# Altium project MungBeanSprout.PrjPCB
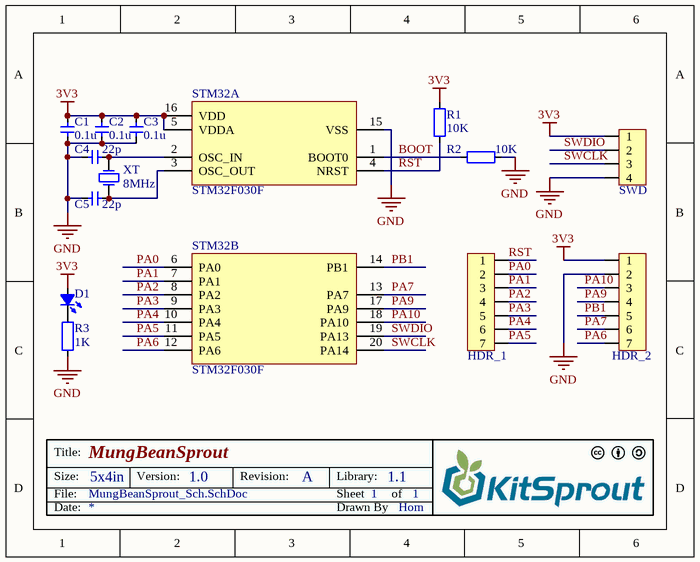
[diagram p0: MungBeanSprout_Sch.SchDoc]
1 sheet, 14 parts. Net scope: global (net labels, ports and power ports of the same name join across sheets).
Board file: MungBeanSprout_Pcb.PcbDoc

## Sheet MungBeanSprout_Sch.SchDoc: MungBeanSprout
size 127 x 101 mm; Author: Hom; CompanyName: KitSprout; DrawnBy: Hom; Engineer: Hom; Organization: KitSprout; Revision: A; SheetNumber: 1; SheetTotal: 1; Version: 1.0; LibVersion: 1.1; PageSetup: Record=PageOptions|CenterHorizontal=True|CenterVertical=True|PrintScale=1.00|XCorrection=1.00|YCorrection=1.00|PrintKind=0|BorderSize=5000000|LeftOffset=0|BottomOffset=0|Orientation=2|PaperLength=1000|PaperWidth=1000|Scale=100|PaperSource=7|PrintQuality=-4|MediaType=1|DitherType=10|PaperKind=A4|PrintScaleMode=0

### Parts
C1  value 0.1u  [CAP_0603]  (hidden comment: Cap_0603)
C2  value 0.1u  [CAP_0603]  (hidden comment: Cap_0603)
C3  value 0.1u  [CAP_0603]  (hidden comment: Cap_0603)
C4  value 22p  [CAP_0603]  (hidden comment: Cap_0603)
C5  value 22p  [CAP_0603]  (hidden comment: Cap_0603)
D1  LED_0603  [LED_0603_BLUE]  (value not drawn)
HDR_1  HDR1x7_2.54  [HDR1X7_2.54_180]  (value not drawn)
HDR_2  HDR1x7_2.54  [HDR1X7_2.54_180]  (value not drawn)
R1  value 10K  [RES_0603]  (hidden comment: Res_0603)
R2  value 10K  [RES_0603]  (hidden comment: Res_0603)
R3  value 1K  [RES_0603]  (hidden comment: Res_0603)
STM32  STM32F030F  [TSSOP_E170_P0.65_20]  (parts A,B of 2)
SWD  HDR1x4_2.54  [HDR1X4_2.54_90F]  (value not drawn)
XT  value 8MHz  [XT_5032_2]  (hidden comment: XTAL_5032_2P)

### Nets
3V3: C1.1 C2.1 C3.1 D1.1(A) HDR_2.1 R1.1 STM32.5(VDDA) STM32.16(VDD) SWD.1
GND: C1.2 C2.2 C3.2 C4.1 C5.1 HDR_2.2 R2.1 R3.2 STM32.15(VSS) SWD.4
BOOT: R2.2 STM32.1(BOOT0)
PA0: HDR_1.2 STM32.6(PA0)
PA1: HDR_1.3 STM32.7(PA1)
PA2: HDR_1.4 STM32.8(PA2)
PA3: HDR_1.5 STM32.9(PA3)
PA4: HDR_1.6 STM32.10(PA4)
PA5: HDR_1.7 STM32.11(PA5)
PA6: HDR_2.7 STM32.12(PA6)
PA7: HDR_2.6 STM32.13(PA7)
PA9: HDR_2.4 STM32.17(PA9)
PA10: HDR_2.3 STM32.18(PA10)
PB1: HDR_2.5 STM32.14(PB1)
RST: HDR_1.1 R1.2 STM32.4(NRST)
SWCLK: STM32.20(PA14) SWD.3
SWDIO: STM32.19(PA13) SWD.2
NetC4_2: C4.2 STM32.2(OSC_IN) XT.2(OSC2)
NetC5_2: C5.2 STM32.3(OSC_OUT) XT.1(OSC1)
NetD1_2: D1.2(K) R3.1

### Notes on the sheet
- Title:
- Size:
- Date:
- File:
- 5x4in
- Version:
- Revision:
- Sheet
- Drawn By
- Library:
- of

### Library data of the parts
C1-C5 = Cap_0603: Capacitor
D1 = LED_0603: LED
HDR_1 = HDR1x7_2.54T: Header
HDR_2 = HDR1x7_2.54: Header
R1-R3 = Res_0603: Resistor
STM32 = STM32F030F: MCU
SWD = HDR1x4_2.54: Header
XT = XTAL_5032_2P: Crystal Oscillator